# EAGLE schematic schematic (EAGLE 9.6.2)

## Sheet 1 of 3
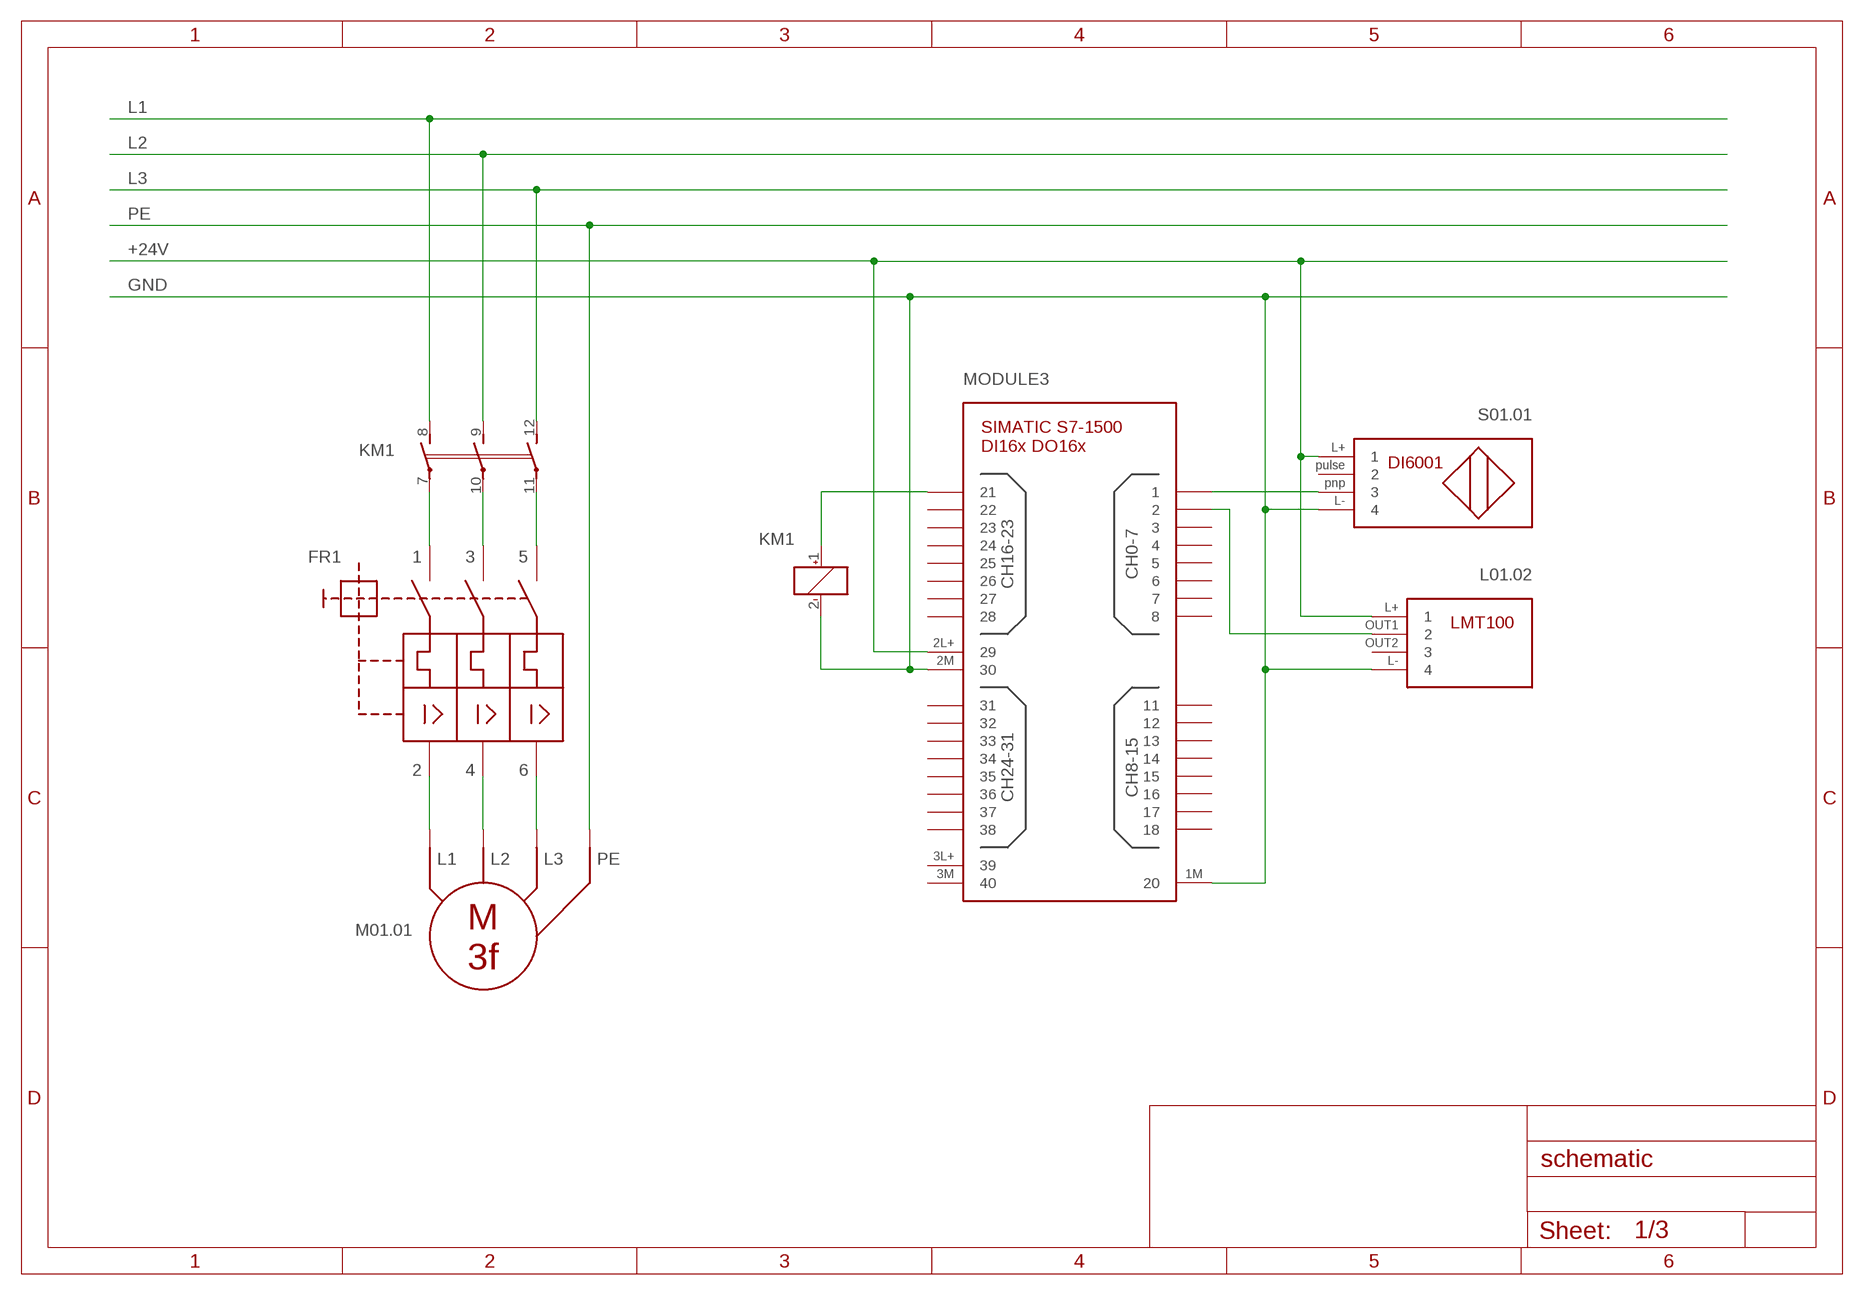
[diagram p0: schematic, sheet 1]

### Parts
FR1  MOTOR_STARTER  (no package)
KM1  SF3-5V  [SF2]
L01.02  LMT100  (no package)
M01.01  MOTOR_3F  (no package)
MODULE3  SIMATICS-16DI/16DO  (no package)
S01.01  DI6001  (no package)

### Nets
+24V: L01.02.1 MODULE3.29 S01.01.1 ; also sheet 2,3
GND: KM1.2(1:-) L01.02.4 MODULE3.20 MODULE3.30 S01.01.4 ; also sheet 2,3
L1: KM1.8(3:S) ; also sheet 2
L2: KM1.9(4:S)
L3: KM1.12(5:S)
N$1: MODULE3.1 S01.01.3
N$2: L01.02.2 MODULE3.2
N$3: KM1.1(1:+) MODULE3.21
N$4: FR1.1 KM1.7(3:P)
N$5: FR1.2 KM1.10(4:P)
N$6: FR1.3 KM1.11(5:P)
N$7: FR1.5 M01.01.1
N$8: FR1.4 M01.01.2
N$9: FR1.6 M01.01.3
PE: M01.01.4 ; also sheet 2
Unconnected: KM1.5(2:O) KM1.6(2:P) L01.02.3 MODULE3.3 MODULE3.4 MODULE3.5 MODULE3.6 MODULE3.7 MODULE3.8 MODULE3.11 MODULE3.12 MODULE3.13 MODULE3.14 MODULE3.15 MODULE3.16 MODULE3.17 MODULE3.18 MODULE3.22 MODULE3.23 MODULE3.24 MODULE3.25 MODULE3.26 MODULE3.27 MODULE3.28 MODULE3.31 MODULE3.32 MODULE3.33 MODULE3.34 MODULE3.35 MODULE3.36 MODULE3.37 MODULE3.38 MODULE3.39 MODULE3.40 S01.01.2

### Notes on the sheet
- KM1

## Sheet 2 of 3
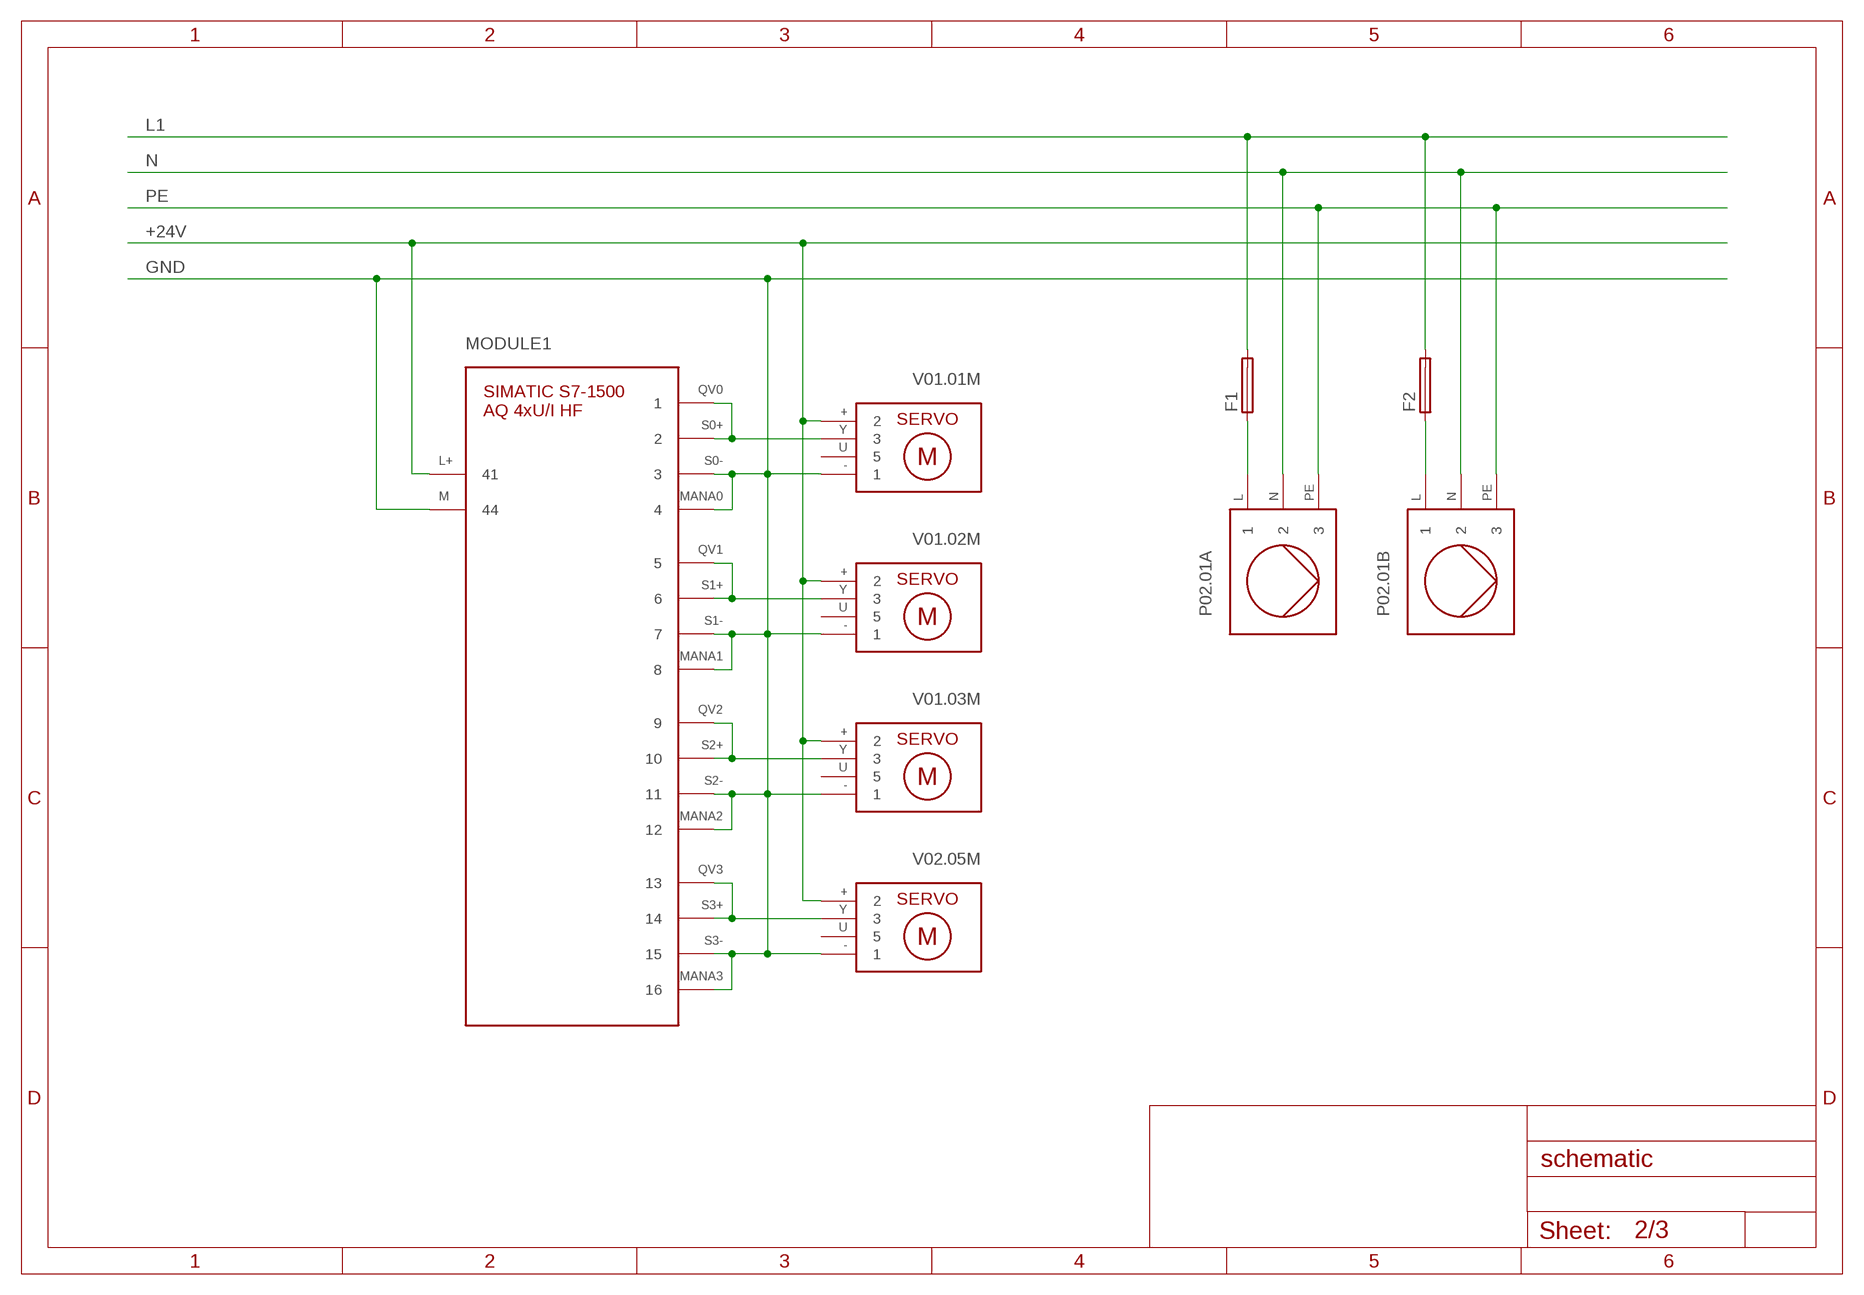
[diagram p1: schematic, sheet 2]

### Parts
F1  19559  [19559]
F2  19559  [19559]
MODULE1  SIMATICS-4XAQ  (no package)
P02.01A  PUMP  (no package)
P02.01B  PUMP  (no package)
V01.01M  SERVO  (no package)
V01.02M  SERVO  (no package)
V01.03M  SERVO  (no package)
V02.05M  SERVO  (no package)

### Nets
+24V: MODULE1.41 V01.01M.2 V01.02M.2 V01.03M.2 V02.05M.2 ; also sheet 1,3
GND: MODULE1.3 MODULE1.4 MODULE1.7 MODULE1.8 MODULE1.11 MODULE1.12 MODULE1.15 MODULE1.16 MODULE1.44 V01.01M.1 V01.02M.1 V01.03M.1 V02.05M.1 ; also sheet 1,3
L1: F1.2 F2.2 ; also sheet 1
N: P02.01A.2 P02.01B.2
N$10: MODULE1.5 MODULE1.6 V01.02M.3
N$11: MODULE1.1 MODULE1.2 V01.01M.3
N$12: MODULE1.9 MODULE1.10 V01.03M.3
N$13: MODULE1.13 MODULE1.14 V02.05M.3
N$14: F1.1 P02.01A.1
N$15: F2.1 P02.01B.1
PE: P02.01A.3 P02.01B.3 ; also sheet 1
Unconnected: V01.01M.5 V01.02M.5 V01.03M.5 V02.05M.5

## Sheet 3 of 3
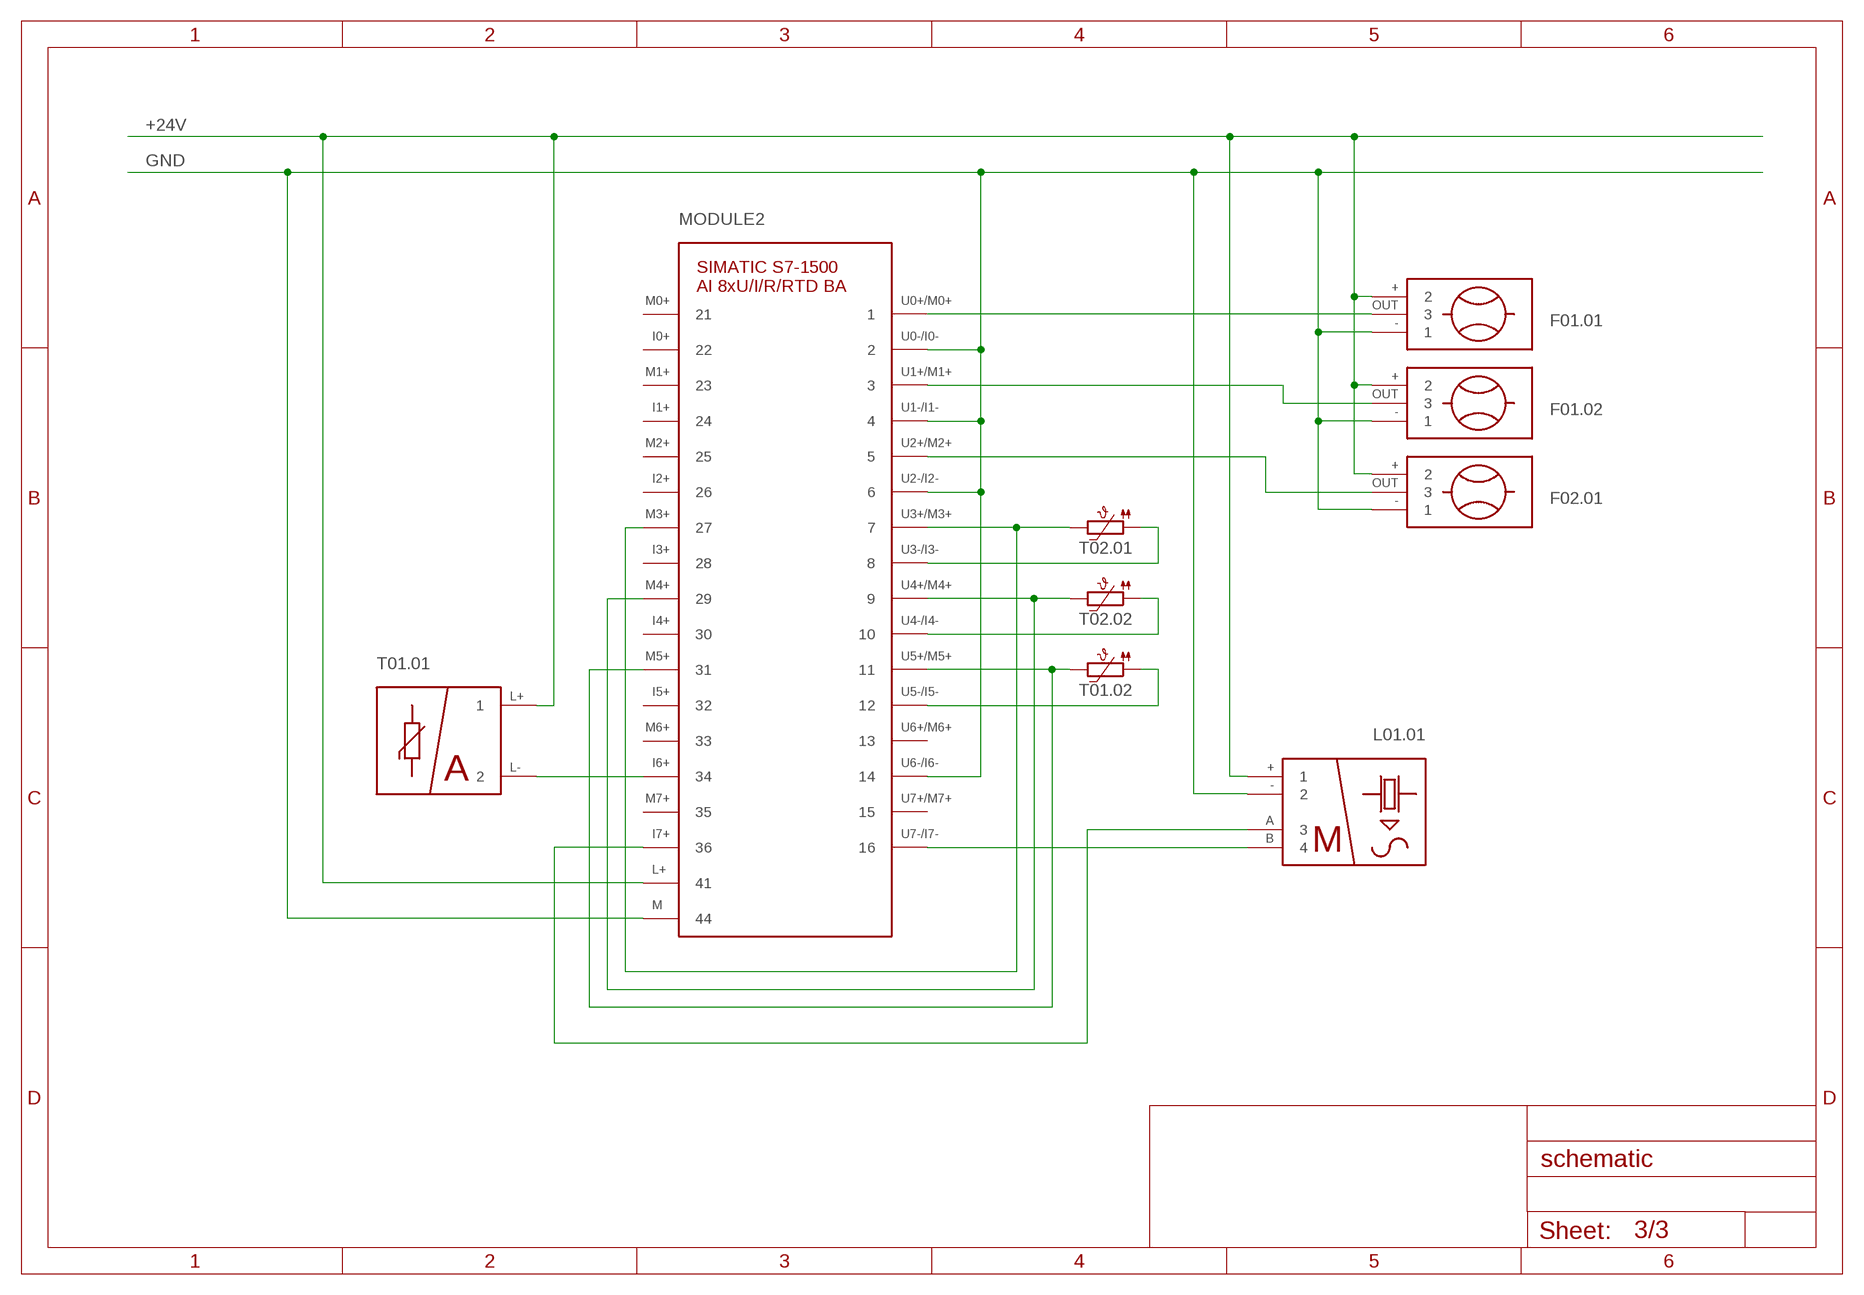
[diagram p2: schematic, sheet 3]

### Parts
F01.01  FLOW_SENSOR  (no package)
F01.02  FLOW_SENSOR  (no package)
F02.01  FLOW_SENSOR  (no package)
L01.01  ULM-70  (no package)
MODULE2  SIMATICS-8XAI  (no package)
T01.01  TA2445  (no package)
T01.02  PTC-SOD70  [SOD70]
T02.01  PTC-SOD70  [SOD70]
T02.02  PTC-SOD70  [SOD70]

### Nets
+24V: F01.01.2 F01.02.2 F02.01.2 L01.01.1 MODULE2.41 T01.01.1 ; also sheet 1,2
GND: F01.01.1 F01.02.1 F02.01.1 L01.01.2 MODULE2.2 MODULE2.4 MODULE2.6 MODULE2.14 MODULE2.44 ; also sheet 1,2
N$16: MODULE2.7 MODULE2.27 T02.01.2
N$17: MODULE2.9 MODULE2.29 T02.02.2
N$18: MODULE2.11 MODULE2.31 T01.02.2
N$19: MODULE2.8 T02.01.1
N$20: MODULE2.10 T02.02.1
N$21: MODULE2.12 T01.02.1
N$22: MODULE2.34 T01.01.2
N$23: L01.01.4 MODULE2.16
N$24: L01.01.3 MODULE2.36
N$25: F01.01.3 MODULE2.1
N$26: F02.01.3 MODULE2.5
N$27: F01.02.3 MODULE2.3
Unconnected: MODULE2.13 MODULE2.15 MODULE2.21 MODULE2.22 MODULE2.23 MODULE2.24 MODULE2.25 MODULE2.26 MODULE2.28 MODULE2.30 MODULE2.32 MODULE2.33 MODULE2.35

## Library data of the parts
F1 F2 = fuse:19559: FUSE HOLDER TR5, Wickmann; MPN: 55900000001; OC_FARNELL: 9516360; OC_NEWARK: 02P0286
F01.01 F01.02 F02.01 = AUP:FLOW_SENSOR
FR1 = AUP:MOTOR_STARTER
KM1 = relay:SF3-*: POLARISED, MONOSTABLE RELAY WITH FORCIBLY GUIDED CONTACTS NAiS Source: http://www.mew-europe.com/.. en_ds_61404_0001.pdf; OC_FARNELL: unknown; OC_NEWARK: unknown
L01.01 = AUP:ULM-70
L01.02 = AUP:LMT100
M01.01 = AUP:MOTOR_3F
MODULE1 = AUP:SIMATICS-4XAQ
MODULE2 = AUP:SIMATICS-8XAI
MODULE3 = AUP:SIMATICS-16DI/16DO
P02.01A P02.01B = AUP:PUMP
S01.01 = AUP:DI6001
T01.01 = AUP:TA2445
T01.02 T02.01 T02.02 = ptc-ntc:PTC-: Positive Temperature Coefficient Resistor (PTC) termistor Philips KTY81-210 - KTY81-252 Source: 153627-da-01-en-Temperatur-Sensor_KTY10-6_Philips.pdf; OC_FARNELL: unknown; OC_NEWARK: unknown
V01.01M V01.02M V01.03M V02.05M = AUP:SERVO